# EAGLE design ScaleOffset (EAGLE 6.5.0)
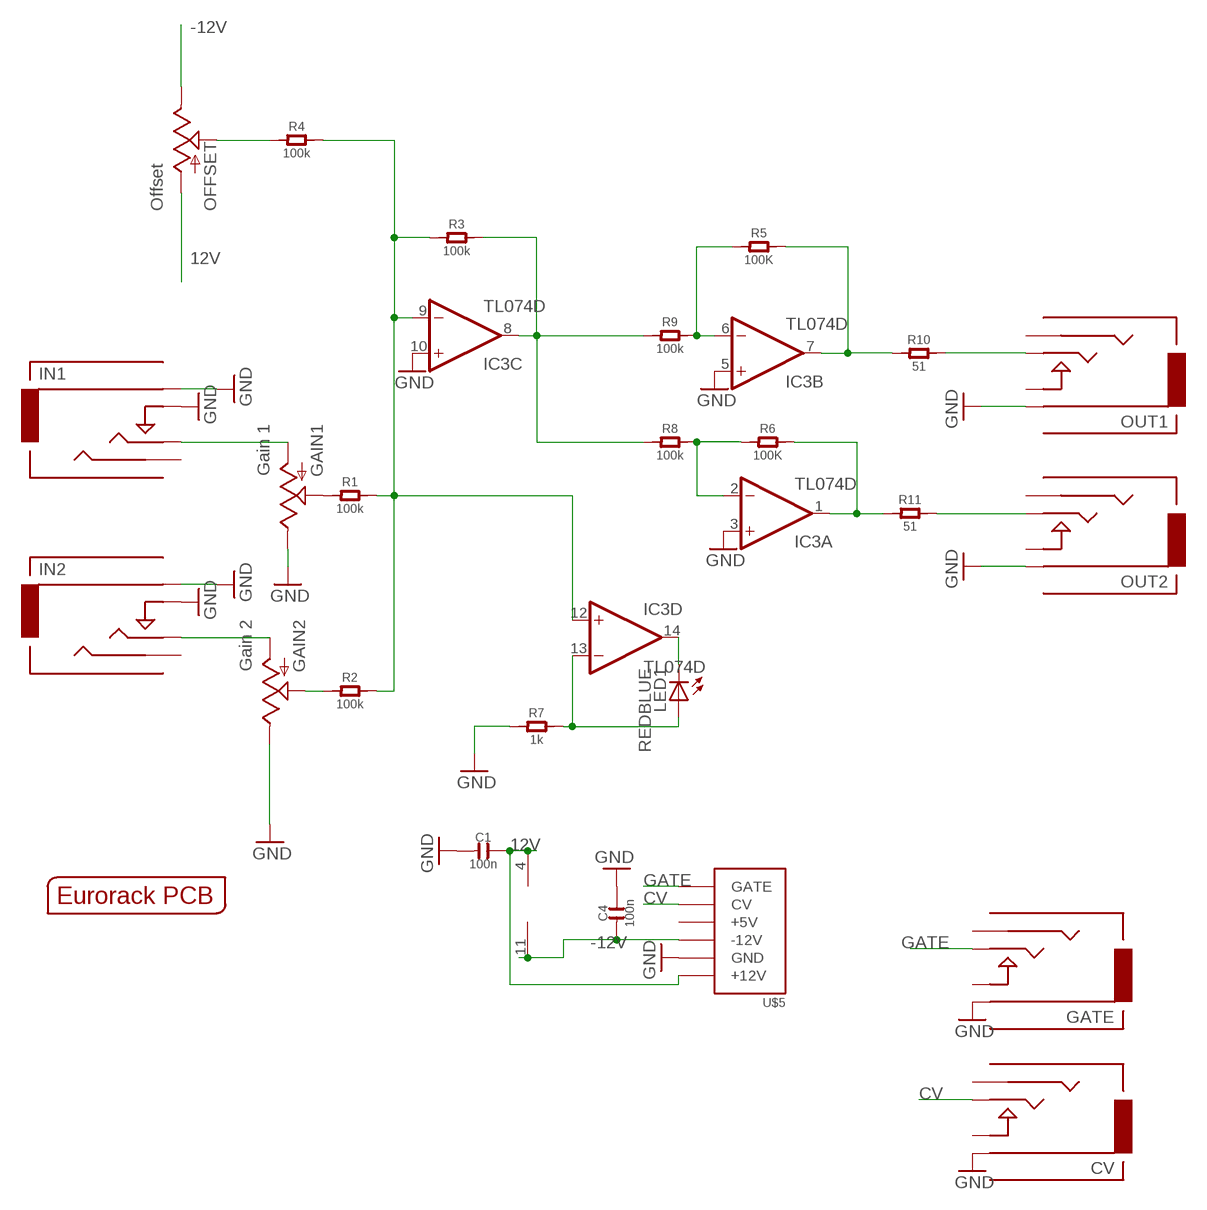
[diagram p0: schematic, sheet 1]

## Parts
C1  100n  C-0603  [C0603]
C4  100n  C-0603  [C0603]
CV  CV  AUDIO-JACKOUTPUT  [3.5MM-JACK-SWITCH-13MM-OUTPUT]
GAIN1  Gain 1  POTZEPHPOT  [OG-POTS_ALPS_POT_VERTICAL]
GAIN2  Gain 2  POTZEPHPOT  [OG-POTS_ALPS_POT_VERTICAL]
GATE  GATE  AUDIO-JACKOUTPUT  [3.5MM-JACK-SWITCH-13MM-OUTPUT]
IC3  TL074D  [SO14]
IN1  Input 1  AUDIO-JACKINPUT  [3.5MM-JACK-SWITCH-13MM-INPUT]
IN2  Input 2  AUDIO-JACKINPUT  [3.5MM-JACK-SWITCH-13MM-INPUT]
LED1  REDBLUE  LED3MM  [LED3MM]
OFFSET  Offset  POTZEPHPOT  [OG-POTS_ALPS_POT_VERTICAL]
OUT1  2  AUDIO-JACKOUTPUT  [3.5MM-JACK-SWITCH-13MM-OUTPUT]
OUT2  1  AUDIO-JACKOUTPUT  [3.5MM-JACK-SWITCH-13MM-OUTPUT]
R1  100k  R-0603  [R0603]
R2  100k  R-0603  [R0603]
R3  100k  R-0603  [R0603]
R4  100k  R-0603  [R0603]
R5  100K  R-0603  [R0603]
R6  100K  R-0603  [R0603]
R7  1k  R-0603  [R0603]
R8  100k  R-0603  [R0603]
R9  100k  R-0603  [R0603]
R10  51  R  [C0805]
R11  51  R  [C0805]
U$5  POWER  [POWER_16]
U$12  EURORACK_PCB6HP  [EURORACK6HPPCB]

## Nets
12V: C1.2 IC3.4(P:V+) OFFSET.P$3(A) U$5.9(+12V) U$5.10(+12V)
-12V: C4.1 IC3.11(P:V-) OFFSET.P$1(E) U$5.1(-12V) U$5.2(-12V)
CV: CV.TIP@1(TIP) CV.TIP@2(TIP) U$5.13(CV) U$5.14(CV)
FBOUT1: IC3.7(B:OUT) R5.2 R10.1
FBOUT2: IC3.1(A:OUT) R6.2 R11.1
GATE: GATE.TIP@1(TIP) GATE.TIP@2(TIP) U$5.15(GATE) U$5.16(GATE)
GND: C1.1 C4.2 CV.RING@1(RING) CV.RING@2(RING) GAIN1.P$1(E) GAIN2.P$1(E) GATE.RING@1(RING) GATE.RING@2(RING) IC3.3(A:+IN) IC3.5(B:+IN) IC3.10(C:+IN) IN1.RING@1(RING) IN1.RING@2(RING) IN1.SWITCH@1(SWITCH) IN1.SWITCH@2(SWITCH) IN2.RING@1(RING) IN2.RING@2(RING) IN2.SWITCH@1(SWITCH) IN2.SWITCH@2(SWITCH) OUT1.RING@1(RING) OUT1.RING@2(RING) OUT2.RING@1(RING) OUT2.RING@2(RING) R7.1 U$5.3(GND) U$5.4(GND) U$5.5(GND) U$5.6(GND) U$5.7(GND) U$5.8(GND)
N$1: IC3.6(B:-IN) R5.1 R9.2
N$3: GAIN2.P$3(A) IN2.TIP@1(TIP) IN2.TIP@2(TIP)
N$4: GAIN1.P$3(A) IN1.TIP@1(TIP) IN1.TIP@2(TIP)
N$5: GAIN1.P$2(S) R1.1
N$6: GAIN2.P$2(S) R2.1
N$8: IC3.8(C:OUT) R3.2 R8.1 R9.1
N$9: IC3.14(D:OUT) LED1.K(C)
N$11: IC3.13(D:-IN) LED1.A R7.2
N$12: IC3.2(A:-IN) R6.1 R8.2
OFFSET: OFFSET.P$2(S) R4.1
OUT1: OUT1.TIP@1(TIP) OUT1.TIP@2(TIP) R10.2
OUT2: OUT2.TIP@1(TIP) OUT2.TIP@2(TIP) R11.2
SUMMING: IC3.9(C:-IN) IC3.12(D:+IN) R1.2 R2.2 R3.1 R4.2
Unconnected: CV.SECOND@1(SECOND) CV.SECOND@2(SECOND) CV.SWITCH@1(SWITCH) CV.SWITCH@2(SWITCH) GATE.SECOND@1(SECOND) GATE.SECOND@2(SECOND) GATE.SWITCH@1(SWITCH) GATE.SWITCH@2(SWITCH) IN1.SECOND@1(SECOND) IN1.SECOND@2(SECOND) IN2.SECOND@1(SECOND) IN2.SECOND@2(SECOND) OUT1.SECOND@1(SECOND) OUT1.SECOND@2(SECOND) OUT1.SWITCH@1(SWITCH) OUT1.SWITCH@2(SWITCH) OUT2.SECOND@1(SECOND) OUT2.SECOND@2(SECOND) OUT2.SWITCH@1(SWITCH) OUT2.SWITCH@2(SWITCH) U$5.11(+5V) U$5.12(+5V)

## Library data of the parts
C1 C4 = OPL:C*
CV GATE IN1 IN2 OUT1 OUT2 = EurorackModularParts:AUDIO-JACK: Switching Mono 3.5mm Audio Jack from Erthenvar.
GAIN1 GAIN2 OFFSET = EurorackModularParts:POT
IC3 = EurorackModularParts:TL074: OP AMP
LED1 = SparkFun-LED:LED: LEDs Standard schematic elements and footprints for 5mm, 3mm, 1206, and 0603 sized LEDs. 5mm - Spark Fun Electronics SKU : COM-00529 (and others)
R1-R11 = OPL:R*
U$5 = EurorackModularParts:POWER
U$12 = EurorackModularParts:EURORACK_PCB

## Net classes
0 default: width 0.254 mm

## Board
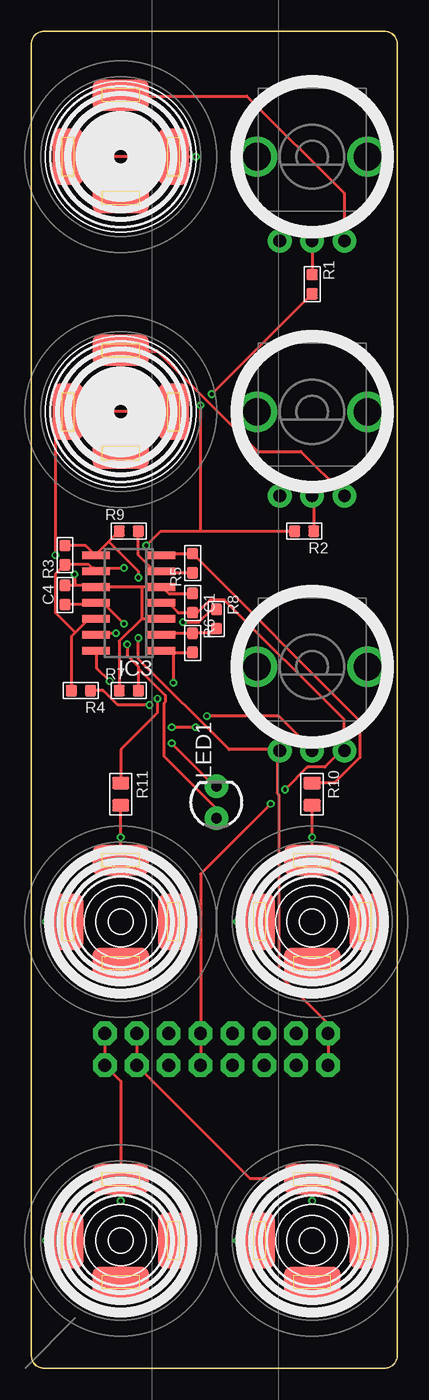
[diagram p1: board, top side]
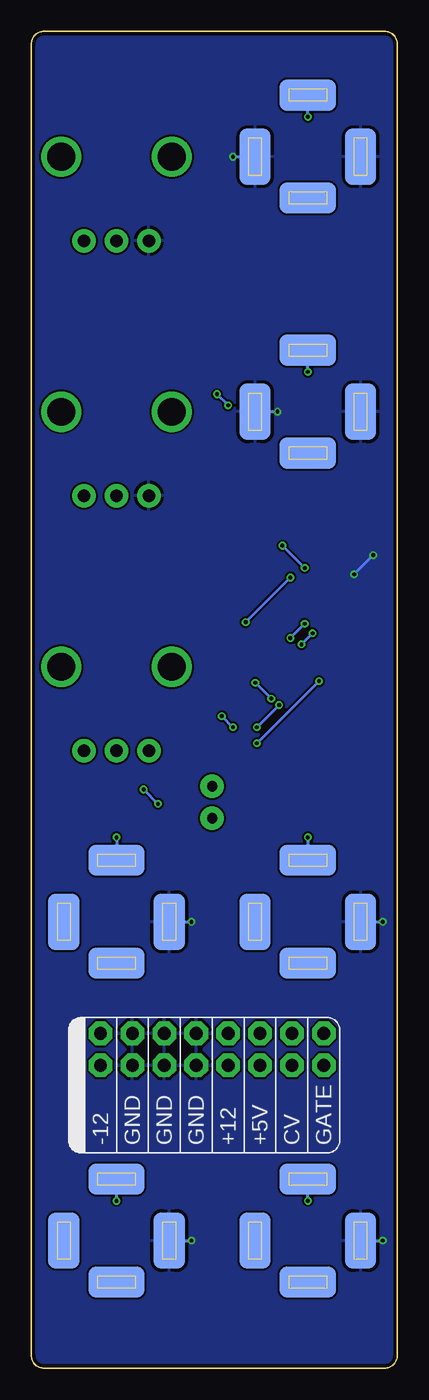
[diagram p2: board, bottom side, seen from below]

Size 29.14 x 106.5 mm. Coordinates in mm from the lower left corner, seen from the top.
Copper layers (1*16): Top 0.035mm / dielectric 1.5mm / Bottom 0.035mm
Design rules "ITEADstudio_DRC": minimum track width 6mil, minimum drill 12mil, track to track 6mil, track to pad 6mil, pad to pad 6mil, via to via 6mil, smd to smd 0mil, copper to edge 10mil, drill to drill 10mil, minimum pad ring 10mil, minimum via ring 6mil, stop-mask expansion 2mil, vias tented up to drill 100mil, thermal gap 10mil

### Footprints (pad centres in the part's own frame; a part is rotated, then mirrored left to right if it is on the bottom)
C0603 = smd 0.889 x 0.889: 1 -0.762,0; 2 0.762,0
3.5MM-JACK-SWITCH-13MM-OUTPUT = smd 2.5 x 4.5: RING@1 -4.2,0; SWITCH@1 4.2,0 | smd 2.5 x 4.5 bottom: RING@2 -4.2,0; SWITCH@2 4.2,0 | smd 4.5 x 2.5: SECOND@1 0,-3.3; TIP@1 0,4.9 | smd 4.5 x 2.5 bottom: SECOND@2 0,-3.3; TIP@2 0,4.9
OG-POTS_ALPS_POT_VERTICAL = drill 1 pad 1.88: P$1 -2.58,-6.7; P$2 0,-6.7; P$3 2.58,-6.7 | drill 2.2 pad 3.175: P$4 4.4,0; P$5 -4.4,0
SO14 = smd 0.6 x 2.2: 1 -3.81,-2.6; 2 -2.54,-2.6; 3 -1.27,-2.6; 4 0,-2.6; 5 1.27,-2.6; 6 2.54,-2.6; 7 3.81,-2.6; 8 3.81,2.6; 9 2.54,2.6; 10 1.27,2.6; 11 0,2.6; 12 -1.27,2.6; 13 -2.54,2.6; 14 -3.81,2.6
3.5MM-JACK-SWITCH-13MM-INPUT = smd 2.5 x 4.5: RING@1 -4.2,0; SWITCH@1 4.2,0 | smd 2.5 x 4.5 bottom: RING@2 -4.2,0; SWITCH@2 4.2,0 | smd 4.5 x 2.5: SECOND@1 0,-3.3; TIP@1 0,4.9 | smd 4.5 x 2.5 bottom: SECOND@2 0,-3.3; TIP@2 0,4.9
LED3MM = drill 0.813 pad 1.88: A -1.27,0; K 1.27,0
R0603 = smd 0.889 x 0.889: 1 -0.762,0; 2 0.762,0
C0805 = smd 1.016 x 1.397: 1 -0.889,0; 2 0.889,0
POWER_16 = drill 1.016 pad 1.88 octagon: 1 -6.35,-1.27; 2 -6.35,1.27; 3 -3.81,-1.27; 4 -3.81,1.27; 5 -1.27,-1.27; 6 -1.27,1.27; 7 1.27,-1.27; 8 1.27,1.27; 9 3.81,-1.27; 10 3.81,1.27; 11 6.35,-1.27; 12 6.35,1.27; 13 8.89,-1.27; 14 8.89,1.27; 15 11.43,-1.27; 16 11.43,1.27

### Placement (x,y rotation side)
C1  12.84,60.96 270 top
C4  2.67,61.59 90 top
CV  22.36,10.16 0 top
GAIN1  22.36,96.52 0 top
GAIN2  22.36,76.2 0 top
GATE  7.12,10.16 0 top
IC3  7.76,60.96 90 top
IN1  7.12,96.52 0 top
IN2  7.12,76.2 0 top
LED1  14.74,45.09 90 top
OFFSET  22.36,55.88 0 top
OUT1  22.36,35.56 0 top
OUT2  7.12,35.56 0 top
R1  22.36,86.36 270 top
R2  21.73,66.67 180 top
R3  2.67,64.77 90 top
R4  3.95,53.98 180 top
R5  12.84,64.14 90 top
R6  12.84,57.78 270 top
R7  7.76,53.98 0 top
R8  14.74,59.69 270 top
R9  7.76,66.67 0 top
R10  22.36,45.72 270 top
R11  7.12,45.72 270 top
U$5  17.28,25.4 0 bottom
U$12  -0.5,0 0 top

### Tracks (layer width: path | path; a pad name or v marks a point on that pad's centre or on a via)
12V  (via drill 0.3)
  Top 0.254: U$5.9 U$5.10 13.47,39.37 v19.06,44.96 | IC3.4 10.93,60.96 11.69,60.2 C1.2 13.22,60.2 14.23,61.21 15.38,61.21 24.9,51.69 24.9,49.28 OFFSET.P$3 24.77,49.28 23.38,47.88 21.98,47.88 v20.2,46.1
  Bottom 0.254: v20.2,46.1 v19.06,44.96
-12V  (via drill 0.3)
  Top 0.254: U$5.1 U$5.2 23.63,27.43 19.69,31.37 19.69,45.72 19.57,45.85 19.57,49.28 | C4.1 4.96,60.83 5.09,60.96 IC3.11 5.72,60.96 v7.37,59.31 | v8.52,58.17 8.52,56.52 15.76,49.28 19.57,49.28 | 19.57,49.28 19.69,49.28 OFFSET.P$1 19.57,49.28
  Bottom 0.254: v8.52,58.17 v7.37,59.31
CV  (via drill 0.3)
  Top 0.254: v22.36,13.34 CV.TIP@1 22.36,15.11 17.41,15.11 U$5.13 U$5.14
  Bottom 0.254: v22.36,13.34 CV.TIP@1
FBOUT1
  Top 0.254: IC3.7 10.42,64.77 10.55,64.9 R5.2 26.17,51.56 26.17,48.64 24.14,46.61 R10.1
FBOUT2  (via drill 0.3)
  Top 0.254: 11.31,57.02 10.55,57.02 10.42,57.15 IC3.1 11.31,57.02 | 11.31,57.02 R6.2 | R11.1 7.12,49.28 10.04,52.2 v10.04,53.34 | 11.31,57.02 v11.31,54.61
  Bottom 0.254: v11.31,54.61 v10.04,53.34
GATE  (via drill 0.3)
  Top 0.254: v7.12,13.34 GATE.TIP@1 7.12,22.86 U$5.15 U$5.16
  Bottom 0.254: v7.12,13.34 GATE.TIP@1
GND  (via drill 0.3)
  Top 0.254: R7.1 6.99,57.91 8.77,59.69 | IC3.3 8.77,59.69 | 3.44,62.36 4.96,62.36 5.09,62.23 IC3.10 8.77,62.23 | 3.44,62.36 C4.2 | C1.1 10.93,61.72 10.42,62.23 IC3.5 8.77,62.23 | 8.77,62.23 8.77,59.69 | IN2.SWITCH@2 v9.53,76.2 IN2.RING@2 2.8,76.2 1.91,75.31 v1.91,64.77 | v1.15,10.16 GATE.RING@1 | v13.09,96.52 IN1.SWITCH@2 IN1.RING@2 | v16.39,10.16 CV.RING@1 | v1.15,35.56 OUT2.RING@2 | v16.39,35.56 OUT1.RING@2 | v3.44,63.25 3.44,62.36
  Bottom 0.254: GATE.RING@1 v1.15,10.16 | v13.09,96.52 IN1.SWITCH@2 | CV.RING@1 v16.39,10.16 | OUT2.RING@2 v1.15,35.56 | OUT1.RING@2 v16.39,35.56 | IN2.SWITCH@2 v9.53,76.2 | v1.91,64.77 v3.44,63.25
  pour Bottom: -0.5,106.68 40.14,106.68 40.14,-1.27 -0.5,-1.27
N$1
  Top 0.254: R9.2 8.52,64.77 9.79,63.5 IC3.6 10.42,63.5 10.55,63.37 R5.1
N$3  (via drill 0.3)
  Top 0.254: 7.12,81.03 10.04,81.03 18.04,73.03 21.47,73.03 24.9,69.6 GAIN2.P$3 | 7.12,81.03 v7.12,79.38 | 7.12,81.03 IN2.TIP@2
  Bottom 0.254: v7.12,79.38 IN2.TIP@2
N$4  (via drill 0.3)
  Top 0.254: 7.12,101.35 17.15,101.35 24.9,93.6 24.9,89.92 GAIN1.P$3 | 7.12,101.35 v7.12,99.69 | 7.12,101.35 IN1.TIP@2
  Bottom 0.254: v7.12,99.69 IN1.TIP@2
N$5
  Top 0.254: GAIN1.P$2 R1.1
N$6
  Top 0.254: R2.1 22.49,69.34 22.36,69.47 GAIN2.P$2
N$8  (via drill 0.3)
  Top 0.254: R3.2 4.33,65.53 5.09,64.77 | 5.09,64.77 6.17,65.85 | 6.17,65.85 R9.1 | 5.09,64.77 IC3.8 | R8.1 14.36,60.45 13.34,59.44 v12.07,59.44 | v8.52,62.99 8.52,63.5 6.17,65.85
  Bottom 0.254: v8.52,62.99 v12.07,59.44
N$9  (via drill 0.3)
  Top 0.254: v6.23,54.74 5.21,55.75 5.21,57.15 IC3.14 | v11.18,49.78 14.61,46.35 LED1.K
  Bottom 0.254: v11.18,49.78 v6.23,54.74
N$11  (via drill 0.3)
  Top 0.254: 8.52,55.75 8.52,55.88 7.63,56.77 v7.63,57.66 | 8.52,55.75 R7.2 | v6.74,58.55 5.34,58.55 5.21,58.42 IC3.13 | LED1.A 14.74,44.58 10.55,48.77 10.55,52.96 10.68,53.09 10.68,53.59 8.52,55.75
  Bottom 0.254: v6.74,58.55 v7.63,57.66
N$12
  Top 0.254: R8.2 14.36,58.55 R6.1 10.55,58.55 10.42,58.42 IC3.2
OFFSET  (via drill 0.3)
  Top 0.254: R4.1 5.72,53.98 6.87,52.83 v9.41,52.83 | v13.09,51.05 v11.18,51.05 | v13.98,51.94 19.69,51.94 22.36,49.28 OFFSET.P$2
  Bottom 0.254: v11.18,51.05 v9.41,52.83 | v13.98,51.94 v13.09,51.05
OUT1  (via drill 0.3)
  Top 0.254: OUT1.TIP@2 v22.36,42.29 R10.2
  Bottom 0.254: v22.36,42.29 OUT1.TIP@2
OUT2  (via drill 0.3)
  Top 0.254: OUT2.TIP@2 v7.12,42.29 R11.2
  Bottom 0.254: v7.12,42.29 OUT2.TIP@2
SUMMING  (via drill 0.3)
  Top 0.254: R4.2 3.18,58.29 3.5,58.61 | 3.5,58.61 4.58,59.69 IC3.12 | 13.47,66.67 10.29,66.67 v9.15,65.53 | 13.47,66.67 R2.2 | v7.37,63.75 4.96,63.75 IC3.9 5.09,63.5 4.58,64.01 R3.1 1.91,63.25 1.91,60.2 3.5,58.61 | v14.36,77.6 R1.2 | 13.47,66.67 v13.47,76.71
  Bottom 0.254: v7.37,63.75 v9.15,65.53 | v13.47,76.71 v14.36,77.6